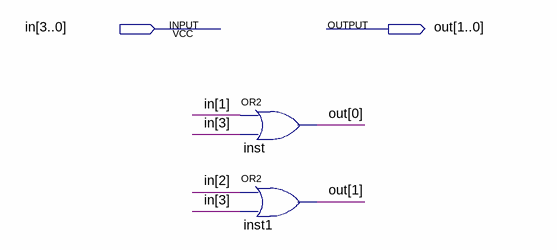
[diagram p0: schematic sheet]
// Quartus schematic Encoder_4x2.bdf as structural Verilog: 2 symbols, 2 pins
module Encoder_4x2 (
  input  [3:0] in,
  output [1:0] out
);

  or inst (out[0], in[1], in[3]);
  or inst1 (out[1], in[2], in[3]);
endmodule
